# Altium schematic sheet GPIO_Raspberry_b+.SchDoc
size A4
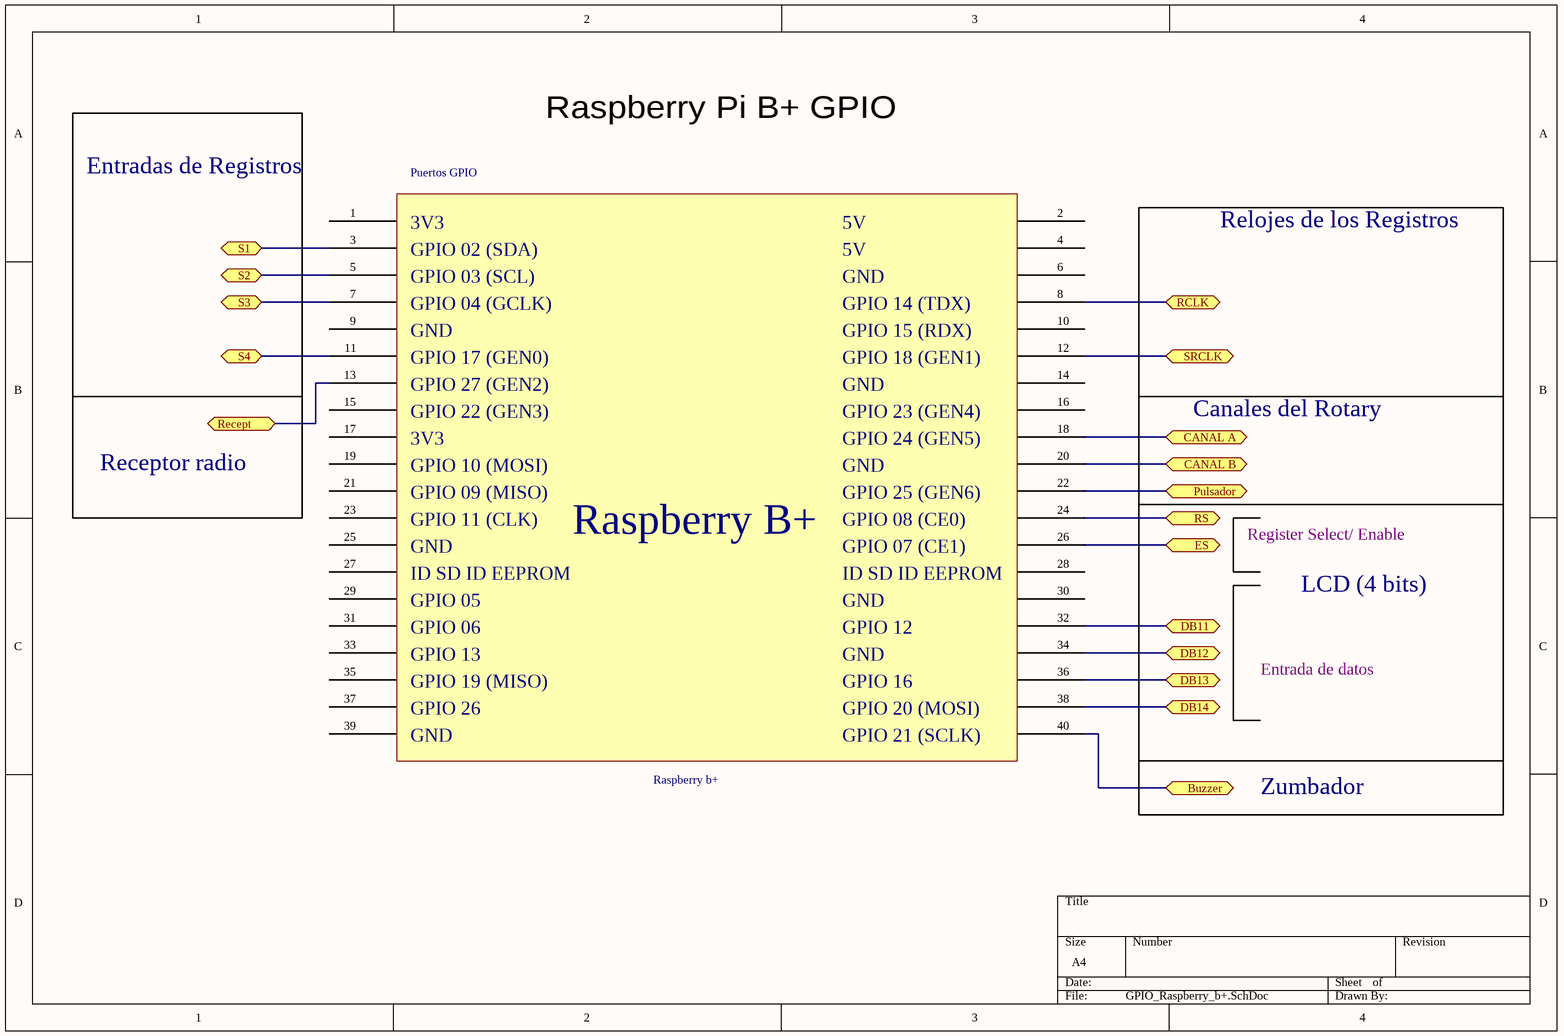
[diagram p0: GPIO_Raspberry_b+.SchDoc]

## Parts
*  Raspberry b+

## Ports
Buzzer, CANAL A, CANAL B, DB11, DB12, DB13, DB14, ES, Pulsador, RCLK, Recept, RS, S1, S2, S3, S4, SRCLK

## Nets
Buzzer: *.40 ; port Buzzer
CANAL A: *.18 ; port CANAL A
CANAL B: *.20 ; port CANAL B
DB11: *.32 ; port DB11
DB12: *.34 ; port DB12
DB13: *.36 ; port DB13
DB14: *.38 ; port DB14
ES: *.26 ; port ES
Pulsador: *.22 ; port Pulsador
RCLK: *.8 ; port RCLK
Recept: *.13 ; port Recept
RS: *.24 ; port RS
S1: *.3 ; port S1
S2: *.5 ; port S2
S3: *.7 ; port S3
S4: *.11 ; port S4
SRCLK: *.12 ; port SRCLK

Not connected (* = marked no-connect by the designer): * 1 2 4 6 9 10 14 15 16 17 19 21 23 25 27 28 29 30 31 33 35 37 39

## Notes on the sheet
- (near *) Entradas de Registros
- (near *) Puertos GPIO
- Raspberry Pi B+ GPIO
- Relojes de los Registros
- Canales del Rotary
- Receptor radio
- Register Select/ Enable
- LCD (4 bits)
- Entrada de datos
- Zumbador
- (in symbol Raspberry b+) 3V3; 5V; GPIO 02 (SDA); GPIO 03 (SCL); GND; GPIO 04 (GCLK); GPIO 14 (TDX); GPIO 15 (RDX); GPIO 17 (GEN0); GPIO 18 (GEN1); GPIO 27 (GEN2); GPIO 22 (GEN3); GPIO 23 (GEN4); GPIO 24 (GEN5); GPIO 10 (MOSI); GPIO 09 (MISO); GPIO 25 (GEN6); GPIO 11 (CLK); GPIO 08 (CE0); Raspberry B+; GPIO 07 (CE1); ID SD ID EEPROM; GPIO 05; GPIO 06; GPIO 12; GPIO 13; GPIO 19 (MISO); GPIO 16; GPIO 26; GPIO 20 (MOSI); GPIO 21 (SCLK)